# Altium project Hand Proto1.PrjPcb
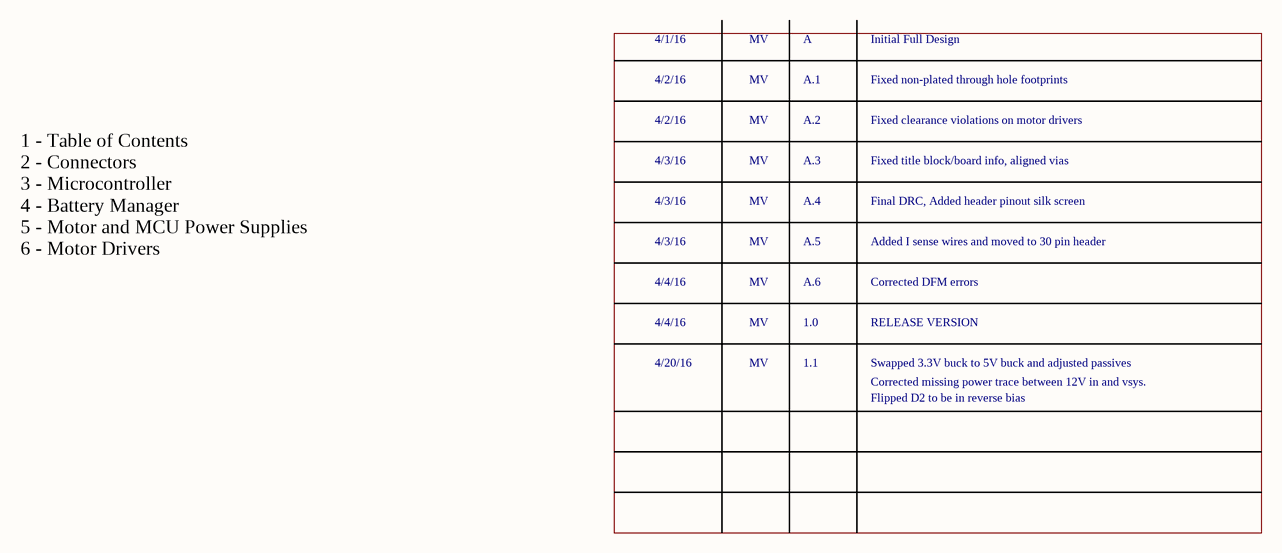
[diagram p0: TOC.SchDoc]
6 sheets, 165 parts. Net scope: global (net labels, ports and power ports of the same name join across sheets).
Board file: Hand Proto 1 PCB.PcbDoc
Sheets:
  TOC.SchDoc
  Connectors.SchDoc
  MCU.SchDoc
  Battery Manager.SchDoc
  Power_Supply.SchDoc
  Motor_Drivers.SchDoc

## Sheet TOC.SchDoc: Table of Contents
size A4; CompanyName: St. Cloud State University; Organization: Senior Design Project; Address1: Prosthetic Hand; Address2: Matthew Varas; Address3: Rachel Mertz; Address4: Donnell Jones; DocumentNumber: 1; Revision: 1.1; SheetNumber: 1; SheetTotal: 6

### Notes on the sheet
- 4/1/16
- 4/2/16
- MV
- A
- A.1
- Initial Full Design
- Fixed non-plated through hole footprints
- 4/3/16
- A.2
- A.3
- Fixed clearance violations on motor drivers
- Fixed title block/board info, aligned vias
- A.4
- Final DRC, Added header pinout silk screen
- 1 - Table of Contents
  2 - Connectors
  3 - Microcontroller
  4 - Battery Manager
  5 - Motor and MCU Power Supplies
  6 - Motor Drivers
- 4/4/16
- A.5
- A.6
- Added I sense wires and moved to 30 pin header
- Corrected DFM errors
- 4/20/16
- 1.0
- 1.1
- RELEASE VERSION
- Swapped 3.3V buck to 5V buck and adjusted passives
- Corrected missing power trace between 12V in and vsys.
- Flipped D2 to be in reverse bias
- Title
- Size:
- Date:
- A4
- Number:
- Time:
- Revision:
- Sheet
- of
- File:

## Sheet Connectors.SchDoc: Connectors
size A4; CompanyName: St. Cloud State University; Organization: Senior Design Project; Address1: Prosthetic Hand; Address2: Matthew Varas; Address3: Rachel Mertz; Address4: Donnell Jones; DocumentNumber: 2; Revision: 1.1; SheetNumber: 2; SheetTotal: 6
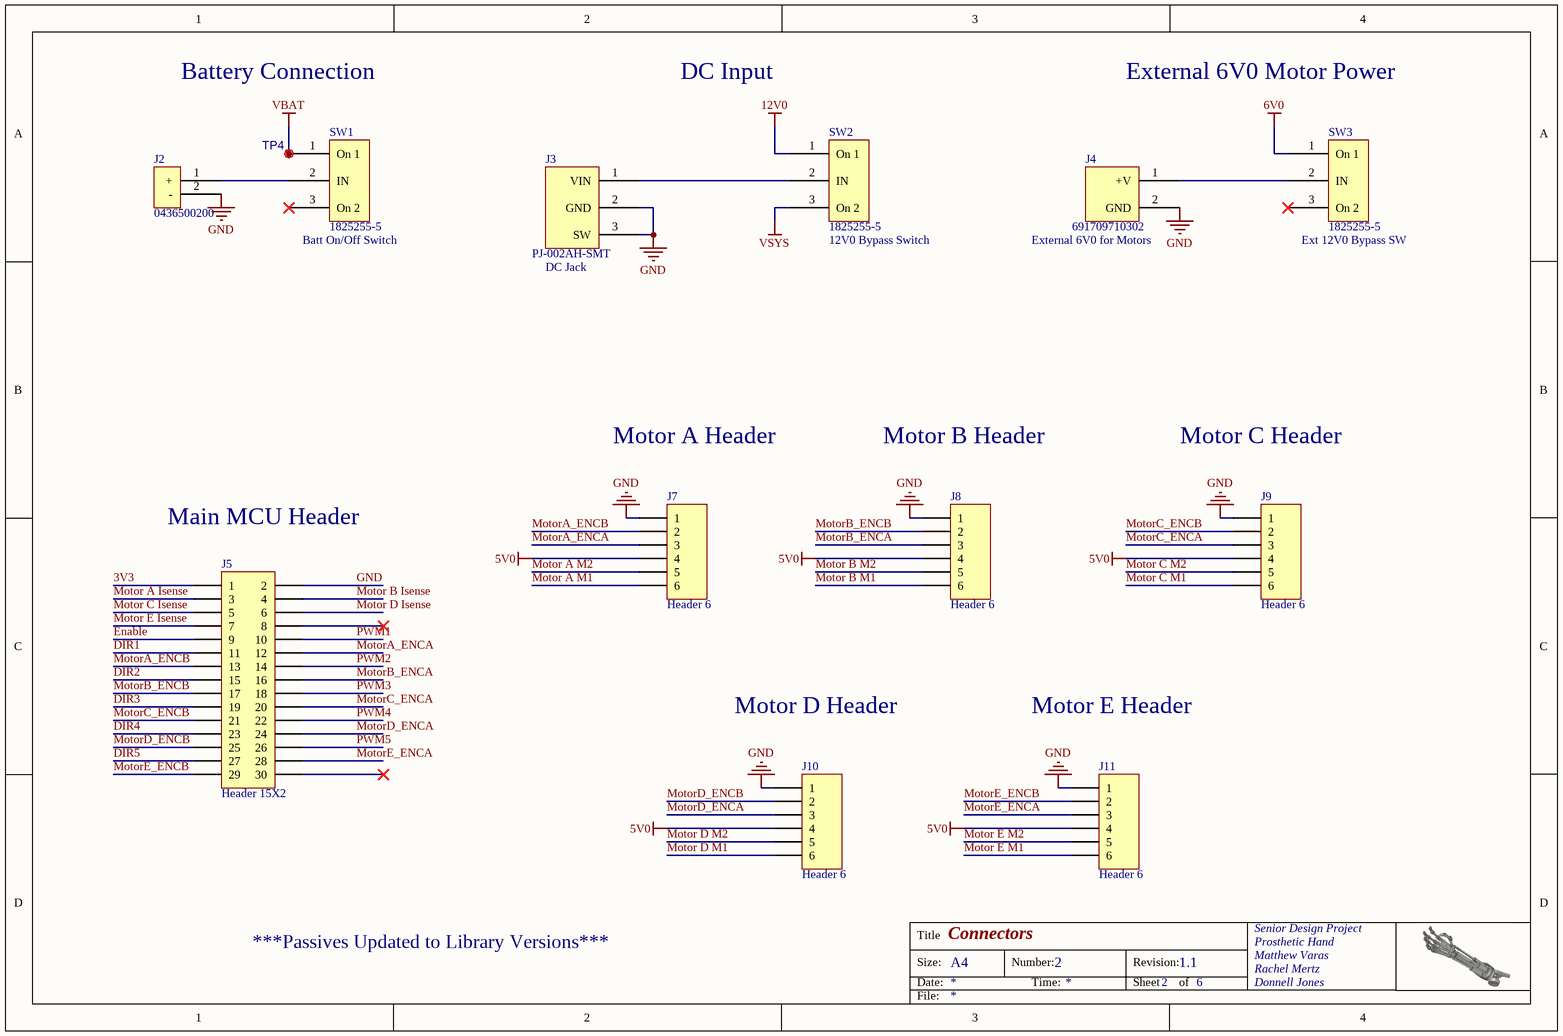
[diagram p1: Connectors.SchDoc]

### Parts
J2  0436500200  [43650-0200]
J3  PJ-002AH-SMT  [PJ-002AH-SMT]
J4  691709710302  [2-Pin Screw Terminal]
J5  Header 15X2  [HDR2X15]
J7  Header 6  [HDR1X6]
J8  Header 6  [HDR1X6]
J9  Header 6  [HDR1X6]
J10  Header 6  [HDR1X6]
J11  Header 6  [HDR1X6]
SW1  1825255-5  [On/Off/On Slider Switch]
SW2  1825255-5  [On/Off/On Slider Switch]
SW3  1825255-5  [On/Off/On Slider Switch]
TP4  Test Point  [Testpoint_70]  (value not drawn)

### Nets
3V3: J5.1
5V0: J7.4 J8.4 J9.4 J10.4 J11.4
6V0: SW3.1(On_1)
12V0: SW2.1(On_1)
GND: J2.2(-) J3.2(GND) J3.3(SW) J4.2(GND) J5.2 J7.1 J8.1 J9.1 J10.1 J11.1
VBAT: SW1.1(On_1) TP4.1(M80)
VSYS: SW2.3(On_2)
DIR1: J5.11
DIR2: J5.15
DIR3: J5.19
DIR4: J5.23
DIR5: J5.27
Enable: J5.9
Motor A Isense: J5.3
Motor A M1: J7.6
Motor A M2: J7.5
Motor B Isense: J5.4
Motor B M1: J8.6
Motor B M2: J8.5
Motor C Isense: J5.5
Motor C M1: J9.6
Motor C M2: J9.5
Motor D Isense: J5.6
Motor D M1: J10.6
Motor D M2: J10.5
Motor E Isense: J5.7
Motor E M1: J11.6
Motor E M2: J11.5
MotorA_ENCA: J5.12 J7.3
MotorA_ENCB: J5.13 J7.2
MotorB_ENCA: J5.16 J8.3
MotorB_ENCB: J5.17 J8.2
MotorC_ENCA: J5.20 J9.3
MotorC_ENCB: J5.21 J9.2
MotorD_ENCA: J5.24 J10.3
MotorD_ENCB: J5.25 J10.2
MotorE_ENCA: J5.28 J11.3
MotorE_ENCB: J5.29 J11.2
PWM1: J5.10
PWM2: J5.14
PWM3: J5.18
PWM4: J5.22
PWM5: J5.26
NetJ2_1: J2.1(+) SW1.2(IN)
NetJ3_1: J3.1(VIN) SW2.2(IN)
NetJ4_1: J4.1(+V) SW3.2(IN)

Not connected (* = marked no-connect by the designer): J5 8* 30*; SW1 3(On_2)*; SW3 3(On_2)*

### Notes on the sheet
- Battery Connection
- DC Input
- External 6V0 Motor Power
- Motor A Header
- Motor B Header
- Motor C Header
- Main MCU Header
- Motor D Header
- Motor E Header
- ***Passives Updated to Library Versions***
- Title
- Size:
- Date:
- A4
- Number:
- Time:
- Revision:
- Sheet
- of
- File:
- (in symbol 1825255-5) Batt On/Off Switch; 12V0 Bypass Switch; Ext 12V0 Bypass SW
- (in symbol PJ-002AH-SMT) DC Jack
- (in symbol Screw Terminal 2-pin) External 6V0 for Motors

### Library data of the parts
J2 = Battery Connector: CONN HEADER 2POS 3MM RT ANG TIN; MFG_NAME01: Molex; DIGI_PN01: WM1860-ND; MFG_PN01: 43650-0200
J3 = PJ-002AH-SMT: CONN POWER JACK 2.1X5.5MM HI CUR; MFG_PN01: PJ-002AH-SMT-TR; DIGI_PN01: CP-002AHPJCT-ND; MFG_NAME01: CUI Inc.
J4 = Screw Terminal 2-pin: CONN TERM BLOCK 2POS 5MM BLACK; MFG_NAME01: Wurth Electronics Inc; DIGI_PN01: 1297-1108-1-ND; MFG_PN01: 691709710302
J5 = Header 15X2: 30 Position Receptacle Connector 0.100" (2.54mm) Through Hole Tin; MFG_PN01: SSW-115-01-T-D; DIGI_PN01: SAM1212-15-ND; MFG_NAME01: Samtec Inc
J7-J11 = Header 6: 6 Positions Header, Unshrouded Connector 0.100" (2.54mm) Through Hole Tin; MFG_PN01: 3-644456-6; MFG_NAME01: TE Connectivity; DIGI_PN01: A31116-ND
SW1-SW3 = 1825255-5: SWITCH SLIDE SPDT 300MA 125V; MFG_NAME01: TE Connectivity; DIGI_PN01: 450-1569-ND; MFG_PN01: 1825255-5
TP4 = Test Point: Test Pad; MFG_PN01: DNP; MFG_NAME01: DNP; DNP: DNP

## Sheet MCU.SchDoc: Microcontroller
size A3; Organization: Senior Design Project; Address1: Prosthetic Hand; Address2: Matthew Varas; Address3: Rachel Mertz; Address4: Donnell Jones; DocumentNumber: 3; Revision: 1.1; SheetNumber: 3; SheetTotal: 6; DocumentName: 3
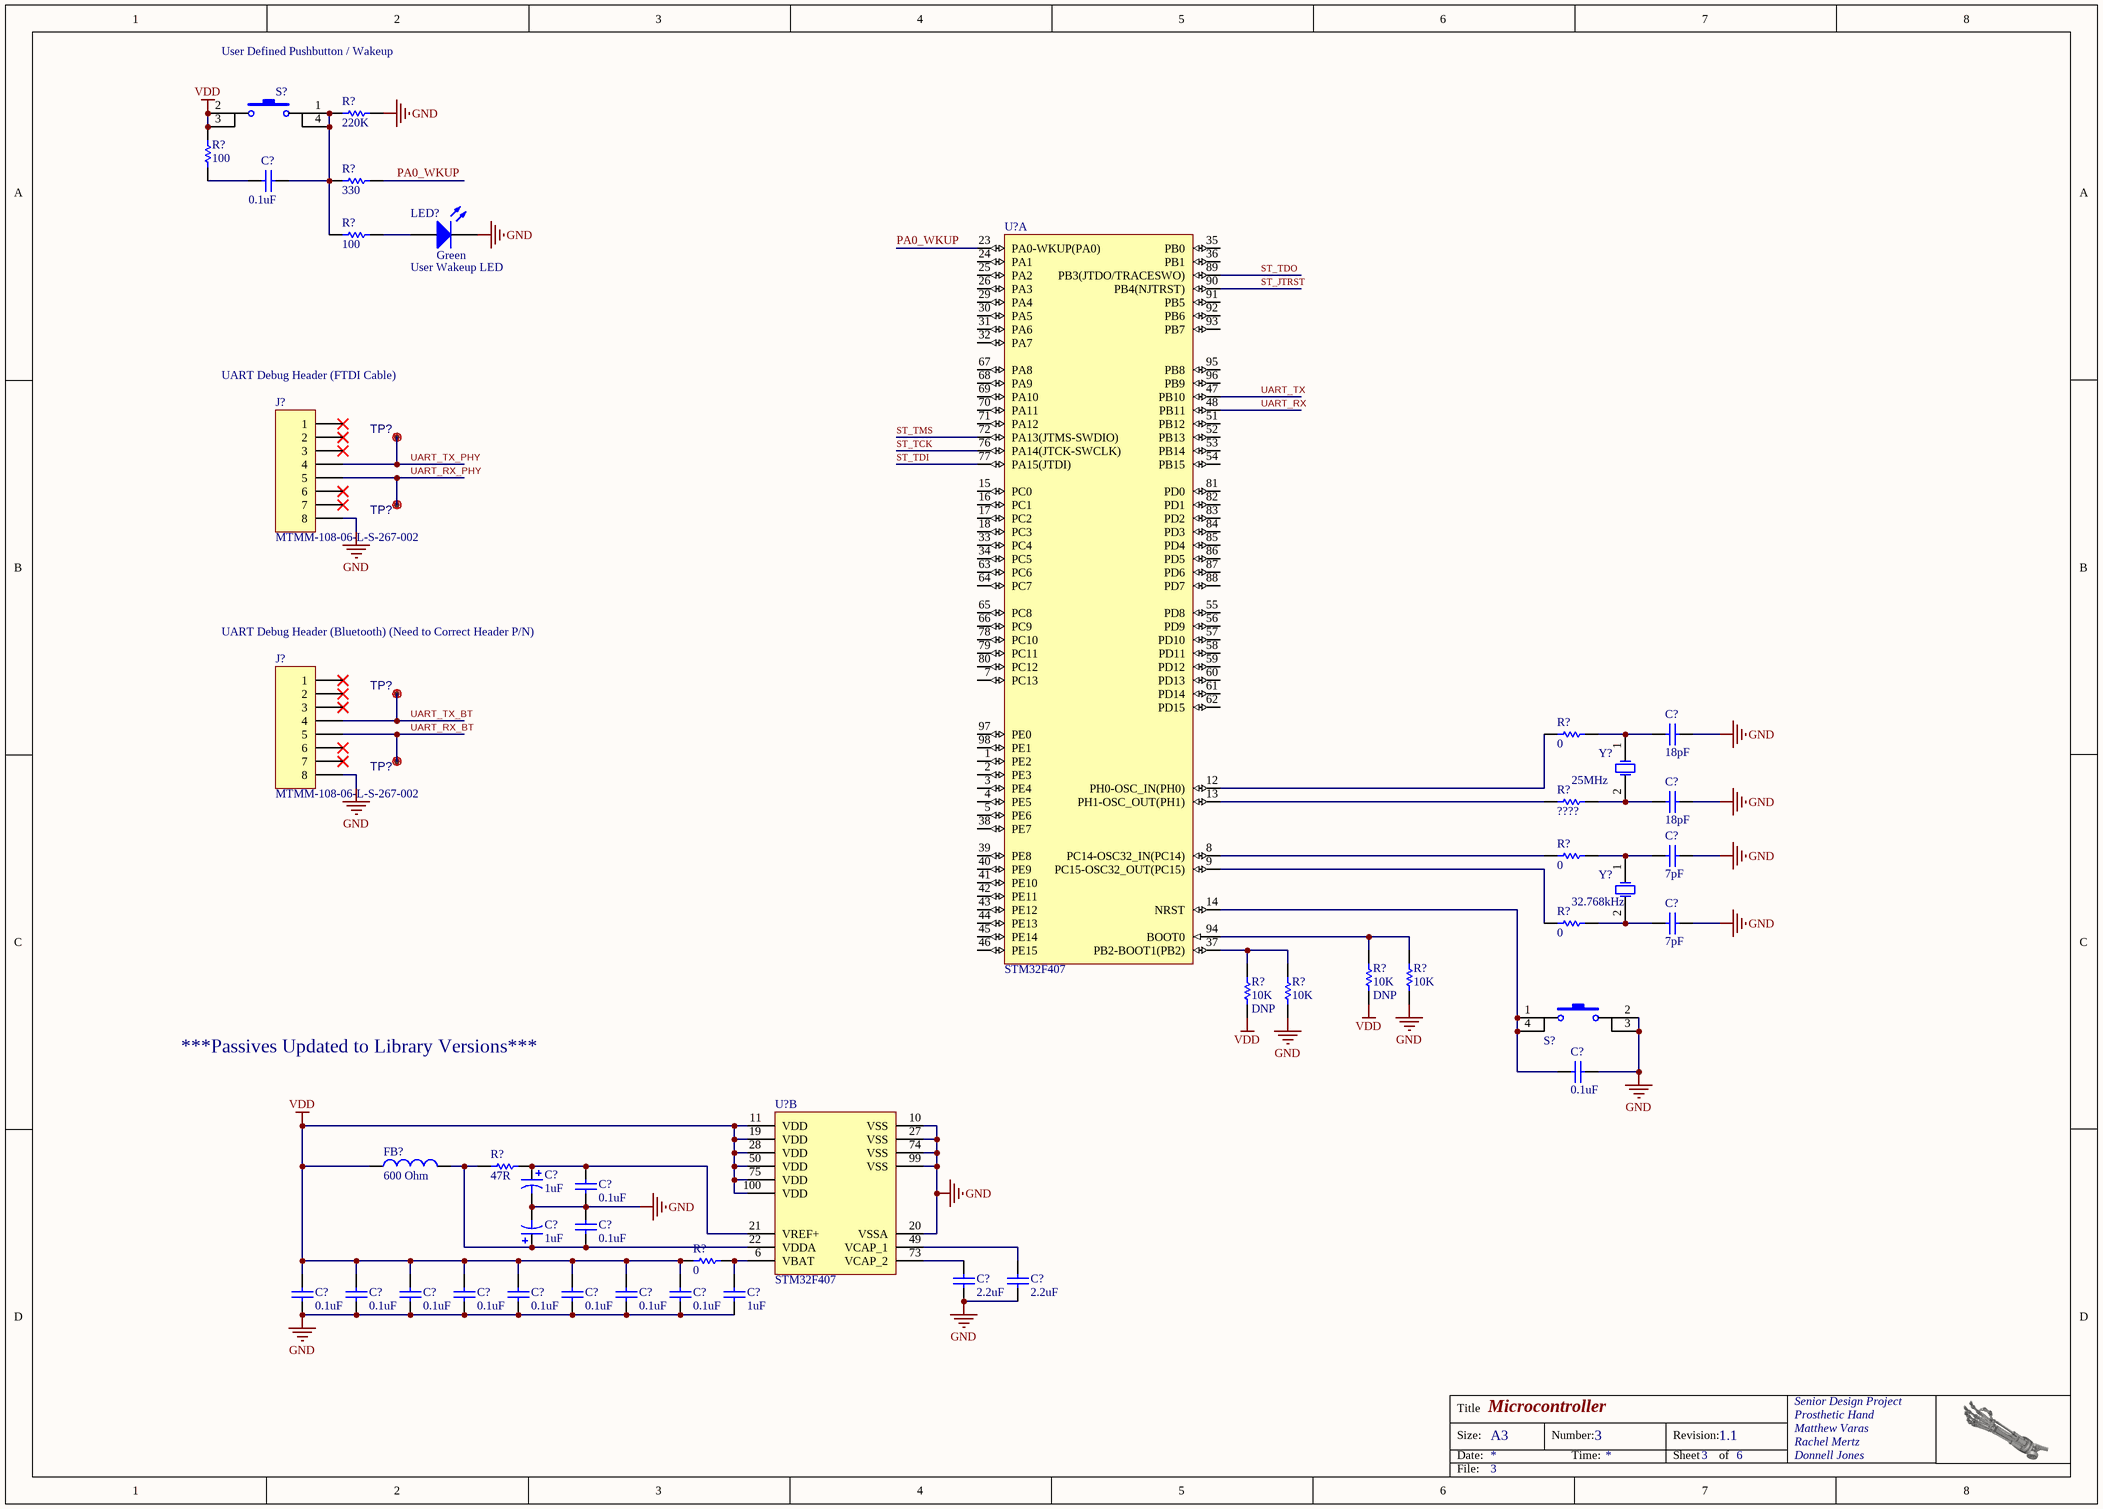
[diagram p2: MCU.SchDoc]

### Parts
(Parts that share a designator on the sheet are numbered #1, #2 ... from top to bottom, then left to right.)
C?#1  value 0.1uF  [0402 Cap]  (hidden comment: Cap)
C?#2  value 18pF  [0603 Cap]  (hidden comment: Cap)
C?#3  value 18pF  [0603 Cap]  (hidden comment: Cap)
C?#4  value 7pF  [0603 Cap]  (hidden comment: Cap)
C?#5  value 7pF  [0603 Cap]  (hidden comment: Cap)
C?#6  value 0.1uF  [0402 Cap]  (hidden comment: Cap)
C?#7  value 1uF  [Cap Tant A]  (hidden comment: Cap Tant)
C?#8  value 0.1uF  [0402 Cap]  (hidden comment: Cap)
C?#9  value 0.1uF  [0402 Cap]  (hidden comment: Cap)
C?#10  value 1uF  [Cap Tant A]  (hidden comment: Cap Tant)
C?#11  value 0.1uF  [0402 Cap]  (hidden comment: Cap)
C?#12  value 0.1uF  [0402 Cap]  (hidden comment: Cap)
C?#13  value 0.1uF  [0402 Cap]  (hidden comment: Cap)
C?#14  value 0.1uF  [0402 Cap]  (hidden comment: Cap)
C?#15  value 0.1uF  [0402 Cap]  (hidden comment: Cap)
C?#16  value 0.1uF  [0402 Cap]  (hidden comment: Cap)
C?#17  value 0.1uF  [0402 Cap]  (hidden comment: Cap)
C?#18  value 0.1uF  [0402 Cap]  (hidden comment: Cap)
C?#19  value 2.2uF  [1206 Cap]  (hidden comment: Cap)
C?#20  value 2.2uF  [1206 Cap]  (hidden comment: Cap)
C?#21  value 1uF  [0603 Cap]  (hidden comment: Cap)
FB?  value 600 Ohm  [0603 Resistor]  (hidden comment: Ferrite Bead)
J?#1  MFG_PN01: MTMM-108-06-L-S-267-002  [2mm_1x8_2NC]  (hidden comment: JTAG Header)
J?#2  MFG_PN01: MTMM-108-06-L-S-267-002  [2mm_1x8_2NC]  (hidden comment: JTAG Header)
LED?  User Wakeup LED  Color: Green  [LED 0603]
R?#1  value 220K  [0402 Resistor]  (hidden comment: Resistor)
R?#2  value 100  [0402 Resistor]  (hidden comment: Resistor)
R?#3  value 330  [0402 Resistor]  (hidden comment: Resistor)
R?#4  value 100  [0402 Resistor]  (hidden comment: Resistor)
R?#5  value 0  [0603 Resistor]  (hidden comment: Resistor)
R?#6  value ????  [0603 Resistor]  (hidden comment: Resistor)
R?#7  value 0  [0603 Resistor]  (hidden comment: Resistor)
R?#8  value 0  [0603 Resistor]  (hidden comment: Resistor)
R?#9  value 10K  [0402 Resistor]  (hidden comment: Resistor)
R?#10  value 10K  [0402 Resistor]  (hidden comment: Resistor)
R?#11  value 10K  [0402 Resistor]  (hidden comment: Resistor)
R?#12  value 10K  [0402 Resistor]  (hidden comment: Resistor)
R?#13  value 47R  [0603 Resistor]  (hidden comment: Resistor)
R?#14  value 0  [0603 Resistor]  (hidden comment: Resistor)
S?#1  SW-PB  [MJTP1138 Switch]  (value not drawn)
S?#2  SW-PB  [MJTP1138 Switch]  (value not drawn)
TP?#1  Test Point  [Testpoint_70]  (value not drawn)
TP?#2  Test Point  [Testpoint_70]  (value not drawn)
TP?#3  Test Point  [Testpoint_70]  (value not drawn)
TP?#4  Test Point  [Testpoint_70]  (value not drawn)
U?#1  STM32F407  [STM-LQFP100_V]  (part A of 2)
U?#2  STM32F407  [STM-LQFP100_V]  (part B of 2)
Y?#1  Frequency: 25MHz  [HC49/US Crystal]  (hidden comment: Crystal)
Y?#2  Frequency: 32.768kHz  [ECX-31B Crystal]  (hidden comment: Crystal)

### Nets
GND: C?#2.1 C?#3.1 C?#4.1 C?#5.1 C?#6.2 C?#7.2 C?#8.2 C?#9.1 C?#10.2 C?#11.2 C?#12.2 C?#13.2 C?#14.2 C?#15.2 C?#16.2 C?#17.2 C?#18.2 C?#19.1 C?#20.1 C?#21.1 J?#1.8 J?#2.8 LED?.2(K) R?#1.2 R?#10.1 R?#12.1 S?#2.2 S?#2.3 U?#2.10(VSS) U?#2.20(VSSA) U?#2.27(VSS) U?#2.74(VSS) U?#2.99(VSS)
VDD: C?#11.1 C?#12.1 C?#13.1 C?#14.1 C?#15.1 C?#16.1 C?#17.1 C?#18.1 FB?.1 R?#2.2 R?#9.1 R?#11.1 R?#14.1 S?#1.2 S?#1.3 U?#2.11(VDD) U?#2.19(VDD) U?#2.28(VDD) U?#2.50(VDD) U?#2.75(VDD) U?#2.100(VDD)
PA0_WKUP: R?#3.2 U?#1.23(PA0-WKUP(PA0))
ST_JTRST: U?#1.90(PB4(NJTRST))
ST_TCK: U?#1.76(PA14(JTCK-SWCLK))
ST_TDI: U?#1.77(PA15(JTDI))
ST_TDO: U?#1.89(PB3(JTDO/TRACESWO))
ST_TMS: U?#1.72(PA13(JTMS-SWDIO))
UART_RX: U?#1.48(PB11)
UART_RX_BT: J?#2.5 TP?#4.1(M80)
UART_RX_PHY: J?#1.5 TP?#2.1(M80)
UART_TX: U?#1.47(PB10)
UART_TX_BT: J?#2.4 TP?#3.1(M80)
UART_TX_PHY: J?#1.4 TP?#1.1(M80)
NetC?#1_1: C?#1.1 R?#1.1 R?#3.1 R?#4.1 S?#1.1 S?#1.4
NetC?#1_2: C?#1.2 R?#2.1
NetC?#2_2: C?#2.2 R?#5.2 Y?#1.1(OSC1)
NetC?#3_2: C?#3.2 R?#6.2 Y?#1.2(OSC2)
NetC?#4_2: C?#4.2 R?#7.2 Y?#2.1(OSC1)
NetC?#5_2: C?#5.2 R?#8.2 Y?#2.2(OSC2)
NetC?#6_1: C?#6.1 S?#2.1 S?#2.4 U?#1.14(NRST)
NetC?#7_1: C?#7.1 C?#8.1 R?#13.2 U?#2.21(VREF+)
NetC?#9_2: C?#9.2 C?#10.1 FB?.2 R?#13.1 U?#2.22(VDDA)
NetC?#19_2: C?#19.2 U?#2.73(VCAP_2)
NetC?#20_2: C?#20.2 U?#2.49(VCAP_1)
NetC?#21_2: C?#21.2 R?#14.2 U?#2.6(VBAT)
NetLED?_1: LED?.1(A) R?#4.2
NetR?#5_1: R?#5.1 U?#1.12(PH0-OSC_IN(PH0))
NetR?#6_1: R?#6.1 U?#1.13(PH1-OSC_OUT(PH1))
NetR?#7_1: R?#7.1 U?#1.8(PC14-OSC32_IN(PC14))
NetR?#8_1: R?#8.1 U?#1.9(PC15-OSC32_OUT(PC15))
NetR?#9_2: R?#9.2 R?#10.2 U?#1.94(BOOT0)
NetR?#11_2: R?#11.2 R?#12.2 U?#1.37(PB2-BOOT1(PB2))

Not connected (* = marked no-connect by the designer): J?#1 1* 2* 3* 6* 7*; J?#2 1* 2* 3* 6* 7*; U?#1 1(PE2) 2(PE3) 3(PE4) 4(PE5) 5(PE6) 7(PC13) 15(PC0) 16(PC1) 17(PC2) 18(PC3) 24(PA1) 25(PA2) 26(PA3) 29(PA4) 30(PA5) 31(PA6) 32(PA7) 33(PC4) 34(PC5) 35(PB0) 36(PB1) 38(PE7) 39(PE8) 40(PE9) 41(PE10) 42(PE11) 43(PE12) 44(PE13) 45(PE14) 46(PE15) 51(PB12) 52(PB13) 53(PB14) 54(PB15) 55(PD8) 56(PD9) 57(PD10) 58(PD11) 59(PD12) 60(PD13) 61(PD14) 62(PD15) 63(PC6) 64(PC7) 65(PC8) 66(PC9) 67(PA8) 68(PA9) 69(PA10) 70(PA11) 71(PA12) 78(PC10) 79(PC11) 80(PC12) 81(PD0) 82(PD1) 83(PD2) 84(PD3) 85(PD4) 86(PD5) 87(PD6) 88(PD7) 91(PB5) 92(PB6) 93(PB7) 95(PB8) 96(PB9) 97(PE0) 98(PE1)

### Notes on the sheet
- User Defined Pushbutton / Wakeup
- UART Debug Header (FTDI Cable)
- UART Debug Header (Bluetooth) (Need to Correct Header P/N)
- ***Passives Updated to Library Versions***
- Title
- Size:
- Date:
- A3
- Number:
- Time:
- Revision:
- Sheet
- of
- File:

### Library data of the parts
C?#1 C?#6 C?#8 C?#9 C?#11-C?#18 = Cap 0402: 0.10µF ±10% 16V X7R Ceramic Capacitor 0402; DIGI_PN01: 311-1338-1-ND; MFG_PN01: CC0402KRX7R7BB104; MFG_NAME01: Yageo; Footprint: 0402
C?#2 C?#3 = Cap 0603: 18pF ±1% 50V C0G, NP0 Ceramic Capacitor 0603; DIGI_PN01: 490-9716-1-ND; MFG_PN01: GRM1885C1H180FA01D; MFG_NAME01: Murata; Footprint: 0603
C?#4 C?#5 = Cap 0603: 7pF ±0.1pF 50V C0G, NP0 Ceramic Capacitor 0603; DIGI_PN01: 1276-2135-1-ND; MFG_PN01: CL10C070BB8NNNC; MFG_NAME01: Samsung; Footprint: 0603
C?#7 C?#10 = Cap Tant A: Tantalum Cap A; MFG_PN01: TAJA105K016RNJ; MFG_NAME01: AVX Corporation; DIGI_PN01: 478-1649-2-ND
C?#19 C?#20 = Cap 1206: 2.2µF ±10% 16V X7R Ceramic Capacitor 1206; DIGI_PN01: 311-1957-1-ND; MFG_PN01: CC1206KKX7R7BB225; MFG_NAME01: Yageo; Footprint: 1206
C?#21 = Cap 0603: 1µF ±10% 16V X5R Ceramic Capacitor 0603; DIGI_PN01: 311-1444-1-ND; MFG_PN01: CC0603KRX5R7BB105; MFG_NAME01: Yageo; Footprint: 0603
FB? = Inductor: FERRITE BEAD 600 OHM 0603 1LN; MFG_PN01: BK1608HS601-T; MFG_NAME01: Taiyo Yuden; DIGI_PN01: 587-1874-1-ND; Footprint: 0603
J?#1 J?#2 = JTAG Header: Header 8-pin keyed for FTDI Cable; MFG_NAME01: Samtec; DIGI_PN01: *
LED? = LED Green SMD: LED GREEN DIFFUSED 0603 SMD; MFG_PN01: SML-D12M8WT86; DIGI_PN01: 511-1578-1-ND; MFG_NAME01: Rohm Semiconductor; Published: 8-Jun-2000; LatestRevisionDate: 08-Jul-2005; LatestRevisionNote: Mech Layer 1 removed.; PackageReference: LED-1; Publisher: Altium Limited; PackageDescription: LED; 2 Leads
R?#1 = Resistor 0402: RES SMD 220K OHM 1% 1/16W 0402; MFG_PN01: AC0402FR-07220KL; MFG_NAME01: Yageo; DIGI_PN01: 311-220KLBCT-ND; Footprint: 0402
R?#2 R?#4 = Resistor 0402: RES SMD 100 OHM 1% 1/16W 0402; MFG_PN01: 311-100LRCT-ND; MFG_NAME01: RC0402FR-07100RL; DIGI_PN01: Yageo; Footprint: 0402
R?#3 = Resistor 0402: RES SMD 330 OHM 1% 1/16W 0402; MFG_PN01: RC0402FR-07330RL; MFG_NAME01: Yageo; DIGI_PN01: 311-330LRCT-ND; Footprint: 0402
R?#5 R?#7 R?#8 R?#14 = Resistor 0603: RES SMD 0.0OHM JUMPER 1/10W 0603; MFG_PN01: RC0603JR-070RL; MFG_NAME01: Yageo; DIGI_PN01: 311-0.0GRCT-ND; Footprint: 0603
R?#6 = Resistor 0603: *; MFG_PN01: *; MFG_NAME01: *; Footprint: 0603; DIGI_PN01: *
R?#9-R?#12 = Resistor 0402: RES SMD 10K OHM 1% 1/16W 0402; MFG_PN01: RC0402FR-0710KL; MFG_NAME01: Yageo; DIGI_PN01: 311-10.0KLRCT-ND; Footprint: 0402; DNP: DNP
R?#13 = Resistor 0603: RES SMD 47 OHM 1% 1/10W 0603; MFG_PN01: RC0603FR-0747RL; MFG_NAME01: Yageo; DIGI_PN01: 311-47.0HRCT-ND; Footprint: 0603
S?#1 S?#2 = SW-PB: SWITCH TACTILE SPST-NO 0.05A 12V; MFG_PN01: MJTP1138ATR; MFG_NAME01: Apem Inc.; DIGI_PN01: 679-2413-1-ND
  S?#2: Published: 24-Mar-1999; LatestRevisionDate: 17-Jul-2002; LatestRevisionNote: Re-released for DXP Platform.; PackageReference: SPST-2; Publisher: Altium Limited; PackageDescription: Switch; 2 Leads
TP?#1-TP?#4 = Test Point: Test Pad; MFG_PN01: DNP; MFG_NAME01: DNP; DNP: DNP
U?#1 U?#2 = STM32F507VGT6: IC MCU 32BIT 1MB FLASH 100LQFP; MFG_PN01: STM32F407VGT6; MFG_NAME01: STMicroelectronics; DIGI_PN01: 497-11605-ND; Footprint: 100-LQFP
Y?#1 = Crystal: 25MHz ±20ppm Crystal 18pF 30 Ohm; MFG_NAME01: ECS Inc.; MFG_PN01: ECS-250-18-5PX-JEM-TR; DIGI_PN01: XC2083CT-ND
Y?#2 = Crystal: 32.768kHz ±20ppm Crystal 7pF 70 kOhm; MFG_NAME01: ECS Inc.; MFG_PN01: ECS-.327-7-34B-TR; DIGI_PN01: XC1656CT-ND

## Sheet Battery Manager.SchDoc: Battery Manager
size A4; CompanyName: St. Cloud State University; Organization: Senior Design Project; Address1: Prosthetic Hand; Address2: Matthew Varas; Address3: Rachel Mertz; Address4: Donnell Jones; DocumentNumber: 4; Revision: 1.1; SheetNumber: 4; SheetTotal: 6
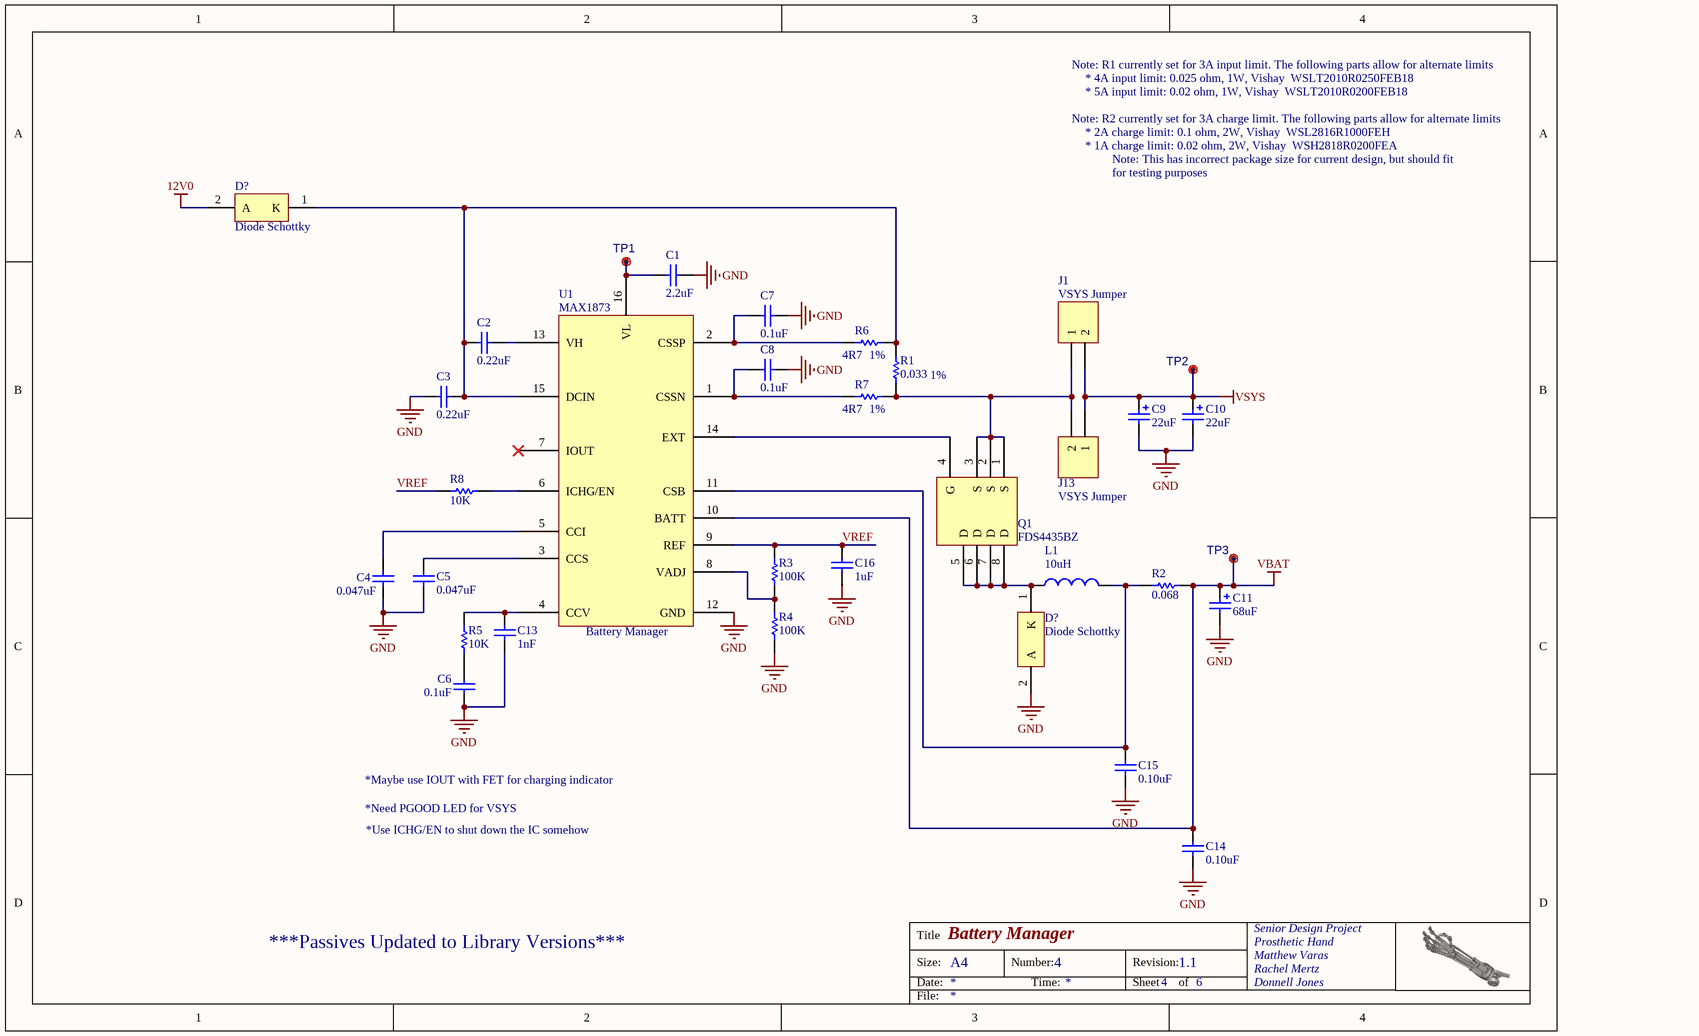
[diagram p3: Battery Manager.SchDoc]

### Parts
(Parts that share a designator on the sheet are numbered #1, #2 ... from top to bottom, then left to right.)
C1  value 2.2uF  [0805 Cap]  (hidden comment: Cap)
C2  value 0.22uF  [0805 Cap]  (hidden comment: Cap)
C3  value 0.22uF  [0805 Cap]  (hidden comment: Cap)
C4  value 0.047uF  [0805 Cap]  (hidden comment: Cap)
C5  value 0.047uF  [0805 Cap]  (hidden comment: Cap)
C6  value 0.1uF  [0805 Cap]  (hidden comment: Cap)
C7  value 0.1uF  Tolerance: 1%  [0805 Cap]  (hidden comment: Cap)
C8  value 0.1uF  [0805 Cap]  (hidden comment: Cap)
C9  22uF  [Cap Tant D]
C10  22uF  [Cap Tant D]
C11  68uF  [Cap Tant E]
C13  value 1nF  [0603 Cap]  (hidden comment: Cap)
C14  value 0.10uF  [0805 Cap]  (hidden comment: Cap)
C15  value 0.10uF  [0805 Cap]  (hidden comment: Cap)
C16  value 1uF  [0805 Cap]  (hidden comment: Cap)
D?#1  Diode Schottky  [ONSC-SMC-2-403-03_V]
D?#2  Diode Schottky  [ONSC-SMC-2-403-03_V]
J1  VSYS Jumper  [HDR1X2]
J13  VSYS Jumper  [HDR1X2]
L1  10uH  [SRR1260 Ind]
Q1  FDS4435BZ  [SOIC-8]
R1  value 0.033  Tolerance: 1%  [2010 Resistor]  (hidden comment: Resistor)
R2  0.068  [WSL2816]
R3  value 100K  [0805 Resistor]  (hidden comment: Resistor)
R4  value 100K  [0805 Resistor]  (hidden comment: Resistor)
R5  value 10K  [0805 Resistor]  (hidden comment: Resistor)
R6  value 4R7  [0603 Resistor]  (hidden comment: Resistor)
R7  value 4R7  Tolerance: 1%  [0603 Resistor]  (hidden comment: Resistor)
R8  value 10K  [0805 Resistor]  (hidden comment: Resistor)
TP1  Test Point  [Testpoint_70]  (value not drawn)
TP2  Test Point  [Testpoint_70]  (value not drawn)
TP3  Test Point  [Testpoint_70]  (value not drawn)
U1  MAX1873  Desc: Battery Manager  [QSOP-16]

### Nets
12V0: D?#1.2(A)
GND: C1.1 C3.2 C4.1 C5.1 C6.2 C7.1 C8.1 C9.2 C10.2 C11.2 C13.1 C14.1 C15.1 C16.1 D?#2.2(A) R4.1 U1.12(GND)
VBAT: C11.1 C14.2 R2.1 TP3.1(M80) U1.10(BATT)
VSYS: C9.1 C10.1 J1.2 J13.1 TP2.1(M80)
VREF: C16.2 R3.2 R8.1 U1.9(REF)
NetC1_2: C1.2 TP1.1(M80) U1.16(VL)
NetC2_1: C2.1 U1.13(VH)
NetC2_2: C2.2 C3.1 D?#1.1(K) R1.2 R6.2 U1.15(DCIN)
NetC4_2: C4.2 U1.5(CCI)
NetC5_2: C5.2 U1.3(CCS)
NetC6_1: C6.1 R5.1
NetC7_2: C7.2 R6.1 U1.2(CSSP)
NetC8_2: C8.2 R7.1 U1.1(CSSN)
NetC13_2: C13.2 R5.2 U1.4(CCV)
NetC15_2: C15.2 L1.2 R2.2 U1.11(CSB)
NetD?#2_1: D?#2.1(K) L1.1 Q1.5(D) Q1.6(D) Q1.7(D) Q1.8(D)
NetJ1_1: J1.1 J13.2 Q1.1(S) Q1.2(S) Q1.3(S) R1.1 R7.2
NetQ1_4: Q1.4(G) U1.14(EXT)
NetR3_1: R3.1 R4.2 U1.8(VADJ)
NetR8_2: R8.2 U1.6(ICHG/EN)

Not connected (* = marked no-connect by the designer): U1 7(IOUT)*

### Notes on the sheet
- Note: R1 currently set for 3A input limit. The following parts allow for alternate limits
- * 4A input limit: 0.025 ohm, 1W, Vishay  WSLT2010R0250FEB18
- * 5A input limit: 0.02 ohm, 1W, Vishay  WSLT2010R0200FEB18
- Note: R2 currently set for 3A charge limit. The following parts allow for alternate limits
- * 2A charge limit: 0.1 ohm, 2W, Vishay  WSL2816R1000FEH
- * 1A charge limit: 0.02 ohm, 2W, Vishay  WSH2818R0200FEA
- Note: This has incorrect package size for current design, but should fit
- for testing purposes
- *Maybe use IOUT with FET for charging indicator
- *Need PGOOD LED for VSYS
- *Use ICHG/EN to shut down the IC somehow
- ***Passives Updated to Library Versions***
- Title
- Size:
- Date:
- A4
- Number:
- Time:
- Revision:
- Sheet
- of
- File:

### Library data of the parts
C1 = Cap 0805: 2.2µF ±10% 50V X5R Ceramic Capacitor 0805; DIGI_PN01: 445-14407-1-ND; MFG_PN01: C2012X5R1H225K085AB; MFG_NAME01: TDK Corporation; Footprint: 0805
C2 C3 = Cap 0805: 0.22µF ±10% 35V X5R Ceramic Capacitor 0805; DIGI_PN01: 587-3366-1-ND; MFG_PN01: GMK212BJ224KGHT; MFG_NAME01: Taiyo Yuden; Footprint: 0805
C4 C5 = Cap 0805: 0.047µF ±10% 50V X7R Ceramic Capacitor 0805; DIGI_PN01: 490-8050-1-ND; MFG_PN01: GCM21BR71H473KA37L; MFG_NAME01: Murata; Footprint: 0805
C6-C8 C14 C15 = Cap 0805: 0.10µF ±10% 50V X7R Ceramic Capacitor 0805; DIGI_PN01: 445-6045-1-ND; MFG_PN01: C2012X7R1H104K125AM; MFG_NAME01: TDK Corporation; Footprint: 0805
C9 C10 = Cap Pol2: CAP TANT 22UF 35V 10% 2917; DIGI_PN01: 478-3356-1-ND; MFG_NAME01: AVX; MFG_PN01: TPSD226K035R0200; Case-EIA: 2917; Value: 22uF
C11 = Cap Pol2: CAP TANT 68UF 25V 20% 2917; DIGI_PN01: 478-4152-1-ND; MFG_NAME01: AVX; MFG_PN01: TPSE686M025R0125; Case-EIA: 2917; Value: 68uF
C13 = Cap 0603: 1000pF ±10% 50V X7R Ceramic Capacitor 0603; DIGI_PN01: 490-1494-1-ND; MFG_PN01: GRM188R71H102KA01D; MFG_NAME01: Murata; Footprint: 0603
C16 = Cap 0805: 1µF ±10% 25V X7R Ceramic Capacitor 0805; DIGI_PN01: 445-1354-1-ND; MFG_PN01: C2012X7R1E105K125AB; MFG_NAME01: TDK Corporation; Footprint: 0805
D?#1 D?#2 = Diode MBRS340T3G: DIODE SCHOTTKY 40V 4A SMC; MFG_NAME01: ON Semiconductor; DIGI_PN01: MBRS340T3GOSCT-ND; MFG_PN01: MBRS340T3G
J1 J13 = Header 2: PEC02SAAN; MFG_NAME01: Sullins Connector Solutions; DIGI_PN01: S1012E-02-ND; MFG_PN01: PEC02SAAN
L1 = SRR1260A-100MCT-ND: FIXED IND 10UH 5.5A 20 MOHM SMD; MFG_NAME01: Bourns; Current Rating: 5.5A; MFG_PN01: SRR1260A-100M; DIGI_PN01: SRR1260A-100MCT-ND; Value: 10uH
Q1 = FDS4435BZ: MOSFET P-CH 30V 8.8A 8-SOIC; MFG_NAME01: Fairchild Semiconductor; DIGI_PN01: FDS4435BZCT-ND; MFG_PN01: FDS4435BZ; Case-EIA: 8-SOIC
R1 = Resistor 2010: RES SMD 0.033 OHM 1% 1W 2010; MFG_PN01: WSL2010R0330FEA18; MFG_NAME01: Vishay Dale; DIGI_PN01: WSLF-.033CT-ND; Footprint: 2010
R2 = CMP-1017-00002-1: RES SMD 0.068 OHM 1% 2W 2816; Case-Metric: 5025; Case-EIA: 2816; MFG_PN01: WSL2816R0680FEH; DIGI_PN01: WSLK-.068CT-ND; MFG_NAME01: Vishay Dale; Tolerance: 1%; Technology: SMT; Power: 2W; Value: 0.068
R3 R4 = Resistor 0805: RES SMD 100K OHM 1% 1/8W 0805; MFG_PN01: RC0805FR-07100KL; MFG_NAME01: Yageo; DIGI_PN01: 311-100KCRCT-ND; Footprint: 0805
R5 R8 = Resistor 0805: RES SMD 10K OHM 1% 1/8W 0805; MFG_PN01: RC0805FR-0710KL; MFG_NAME01: Yageo; DIGI_PN01: 311-10.0KCRCT-ND; Footprint: 0805
R6 R7 = Resistor 0603: RES SMD 4.7 OHM 1% 1/10W 0603; MFG_PN01: RC1608F4R7CS; MFG_NAME01: Samsung; DIGI_PN01: 1276-4486-1-ND; Footprint: 0603
TP1-TP3 = Test Point: Test Pad; MFG_PN01: DNP; MFG_NAME01: DNP; DNP: DNP
U1 = MAX1873: IC CNTRLR CHARGE LI+ 16-QSOP; MFG_PN01: MAX1873REEE+T; MFG_NAME01: Maxim Integrated; DIGI_PN01: MAX1873REEE+TCT-ND; Case-EIA: 16-SSOP

## Sheet Power_Supply.SchDoc: Power Supply
size A4; CompanyName: St. Cloud State University; Organization: Senior Design Project; Address1: Prosthetic Hand; Address2: Matthew Varas; Address3: Rachel Mertz; Address4: Donnell Jones; DocumentNumber: 5; Revision: 1.1; SheetNumber: 5; SheetTotal: 6
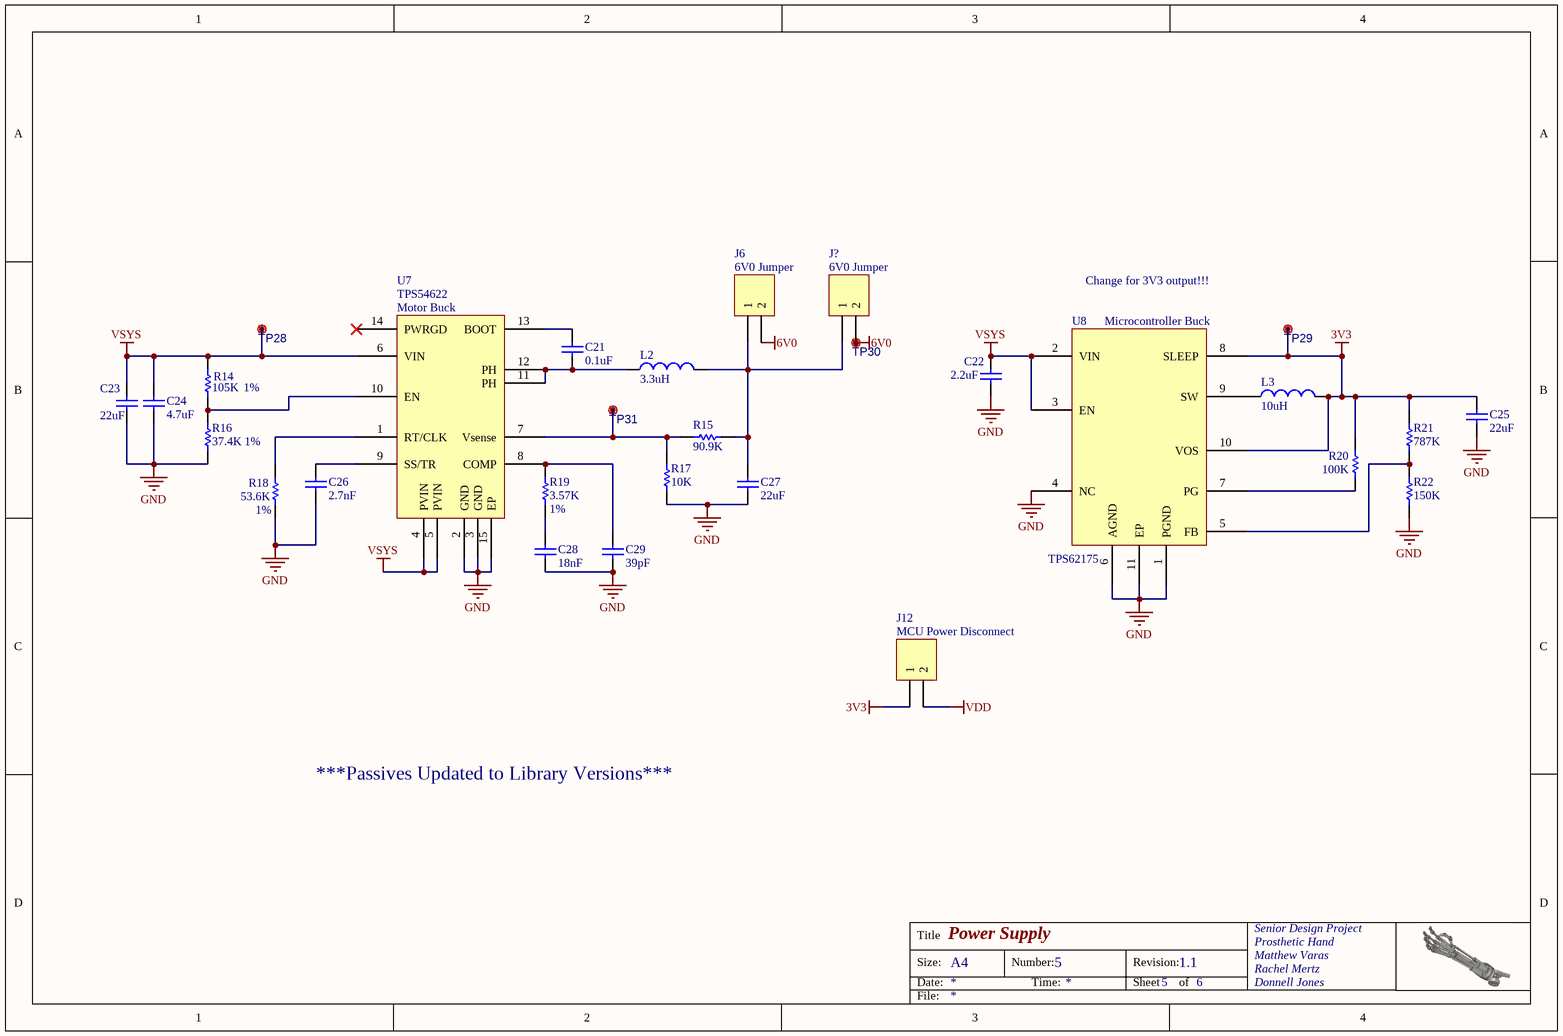
[diagram p4: Power_Supply.SchDoc]

### Parts
(Parts that share a designator on the sheet are numbered #1, #2 ... from top to bottom, then left to right.)
C21  value 0.1uF  [0805 Cap]  (hidden comment: Cap)
C22  value 2.2uF  [0603 Cap]  (hidden comment: Cap)
C23  value 22uF  [1206 Cap]  (hidden comment: Cap)
C24  value 4.7uF  [0805 Cap]  (hidden comment: Cap)
C25  value 22uF  [0805 Cap]  (hidden comment: Cap)
C26  value 2.7nF  [0805 Cap]  (hidden comment: Cap)
C27  value 22uF  [1206 Cap]  (hidden comment: Cap)
C28  value 18nF  [0805 Cap]  (hidden comment: Cap)
C29  value 39pF  [0805 Cap]  (hidden comment: Cap)
J6  6V0 Jumper  [HDR1X2]
J12  MCU Power Disconnect  [HDR1X2]
J?#3  6V0 Jumper  [HDR1X2]
L2  value 3.3uH  [INDM7265X40N]  (hidden comment: Inductor)
L3  value 10uH  [SDR0503]  (hidden comment: Inductor)
R14  value 105K  Tolerance: 1%  [0402 Resistor]  (hidden comment: Resistor)
R15  value 90.9K  [0402 Resistor]  (hidden comment: Resistor)
R16  value 37.4K  Tolerance: 1%  [0402 Resistor]  (hidden comment: Resistor)
R17  value 10K  [0402 Resistor]  (hidden comment: Resistor)
R18  value 53.6K  Tolerance: 1%  [0402 Resistor]  (hidden comment: Resistor)
R19  value 3.57K  Tolerance: 1%  [0402 Resistor]  (hidden comment: Resistor)
R20  value 100K  [0402 Resistor]  (hidden comment: Resistor)
R21  value 787K  [0603 Resistor]  (hidden comment: Resistor)
R22  value 150K  [0603 Resistor]  (hidden comment: Resistor)
TP28  Test Point  [Testpoint_70]  (value not drawn)
TP29  Test Point  [Testpoint_70]  (value not drawn)
TP30  Test Point  [Testpoint_70]  (value not drawn)
TP31  Test Point  [Testpoint_70]  (value not drawn)
U7  TPS54622  Desc: Motor Buck  [S-PVQFN-N14]
U8  TPS62175  Desc: Microcontroller Buck  [R-PWSON-N10]

### Nets
3V3: C25.2 J12.1 L3.2 R20.2 R21.2 TP29.1(M80) U8.8(SLEEP) U8.10(VOS)
6V0: J6.2 J?#3.2 TP30.1(M80)
GND: C22.1 C23.1 C24.1 C25.1 C26.1 C27.1 C28.1 C29.1 R16.1 R17.1 R18.1 R22.1 U7.2(GND) U7.3(GND) U7.15(EP) U8.1(PGND) U8.4(NC) U8.6(AGND) U8.11(EP)
VDD: J12.2
VSYS: C22.2 C23.2 C24.2 R14.2 TP28.1(M80) U7.4(PVIN) U7.5(PVIN) U7.6(VIN) U8.2(VIN) U8.3(EN)
NetC21_1: C21.1 L2.1 U7.11(PH) U7.12(PH)
NetC21_2: C21.2 U7.13(BOOT)
NetC26_2: C26.2 U7.9(SS/TR)
NetC27_2: C27.2 J6.1 J?#3.1 L2.2 R15.2
NetC28_2: C28.2 R19.1
NetC29_2: C29.2 R19.2 U7.8(COMP)
NetL3_1: L3.1 U8.9(SW)
NetR14_1: R14.1 R16.2 U7.10(EN)
NetR15_1: R15.1 R17.2 TP31.1(M80) U7.7(Vsense)
NetR18_2: R18.2 U7.1(RT/CLK)
NetR20_1: R20.1 U8.7(PG)
NetR21_1: R21.1 R22.2 U8.5(FB)

Not connected (* = marked no-connect by the designer): U7 14(PWRGD)*

### Notes on the sheet
- Change for 3V3 output!!!
- ***Passives Updated to Library Versions***
- Title
- Size:
- Date:
- A4
- Number:
- Time:
- Revision:
- Sheet
- of
- File:

### Library data of the parts
C21 = Cap 0805: 0.10µF ±10% 25V X7R Ceramic Capacitor 0805; DIGI_PN01: 478-3755-1-ND; MFG_PN01: 08053C104KAT2A; MFG_NAME01: AVX Corporation; Footprint: 0805
C22 = Cap 0603: 2.2µF ±10% 16V X5R Ceramic Capacitor 0603; DIGI_PN01: 490-3296-1-ND; MFG_PN01: GRM188R61C225KE15D; MFG_NAME01: Murata; Footprint: 0603
C23 = Cap 1206: 22µF ±20% 16V X5R Ceramic Capacitor 1206; DIGI_PN01: 490-4739-1-ND; MFG_PN01: GRM31CR61C226ME15L; MFG_NAME01: Murata; Footprint: 1206
C24 = Cap 0805: 4.7µF ±10% 25V X5R Ceramic Capacitor 0805; DIGI_PN01: 490-3335-1-ND; MFG_PN01: GRM21BR61E475KA12L; MFG_NAME01: Murata; Footprint: 0805
C25 = Cap 0805: 22µF ±20% 6.3V X5R Ceramic Capacitor 0805; DIGI_PN01: 490-1719-1-ND; MFG_PN01: GRM21BR60J226ME39L; MFG_NAME01: Murata; Footprint: 0805
C26 = Cap 0805: 2700pF ±10% 50V X7R Ceramic Capacitor 0805; DIGI_PN01: 311-1130-1-ND; MFG_PN01: CC0805KRX7R9BB272; MFG_NAME01: Yageo; Footprint: 0805
C27 = Cap 1206: 22µF ±10% 10V X5R Ceramic Capacitor 1206; DIGI_PN01: 490-6510-1-ND; MFG_PN01: GRM31CR61A226KE19L; MFG_NAME01: Murata; Footprint: 1206
C28 = Cap 0805: 0.018µF ±10% 50V X7R Ceramic Capacitor 0805; DIGI_PN01: 311-1137-1-ND; MFG_PN01: CC0805KRX7R9BB183; MFG_NAME01: Yageo; Footprint: 0805
C29 = Cap 0805: 39pF ±5% 50V C0G, NP0 Ceramic Capacitor 0805; DIGI_PN01: 311-1106-1-ND; MFG_PN01: CC0805JRNPO9BN390; MFG_NAME01: Yageo; Footprint: 0805
J6 J12 J?#3 = Header 2: as J1 on sheet Battery Manager; MFG_PN01: PEC02SAAN
L2 = Inductor: *; MFG_PN01: SRP6540-3R3M; MFG_NAME01: Bourns Inc.; DIGI_PN01: SRP6540-3R3MCT-ND
L3 = Inductor: FIXED IND 10UH 1.3A 130 MOHM SMD; MFG_PN01: SDR0503-100ML; MFG_NAME01: Bourns Inc.; DIGI_PN01: SDR0503-100MLCT-ND
R14 = Resistor 0402: RES SMD 105K OHM 1% 1/16W 0402; MFG_PN01: CRCW0402105KFKED; MFG_NAME01: Vishay Dale; DIGI_PN01: 541-105KLCT-ND; Footprint: 0402
R15 = Resistor 0402: RES SMD 90.9K OHM 1% 1/16W 0402; MFG_PN01: CRCW040290K9FKED; MFG_NAME01: Vishay Dale; DIGI_PN01: 541-90.9KLCT-ND; Footprint: 0402
R16 = Resistor 0402: RES SMD 37.4K OHM 1% 1/16W 0402; MFG_PN01: CRCW040237K4FKED; MFG_NAME01: Vishay Dale; DIGI_PN01: 541-37.4KLCT-ND; Footprint: 0402
R17 = Resistor 0402: as R?#9 on sheet MCU; Footprint: 0402; DNP: DNP
R18 = Resistor 0402: RES SMD 53.6K OHM 1% 1/16W 0402; MFG_PN01: CRCW040253K6FKED; MFG_NAME01: Vishay Dale; DIGI_PN01: 541-53.6KLCT-ND; Footprint: 0402
R19 = Resistor 0402: RES SMD 3.57K OHM 1% 1/16W 0402; MFG_PN01: CRCW04023K57FKED; MFG_NAME01: Vishay Dale; DIGI_PN01: 541-3.57KLCT-ND; Footprint: 0402
R20 = Resistor 0402: RES SMD 100K OHM 1% 1/16W 0402; MFG_PN01: CRCW0402100KFKED; MFG_NAME01: Vishay Dale; DIGI_PN01: 541-100KLCT-ND; Footprint: 0402
R21 = Resistor 0603: RES SMD 787K OHM 1% 1/10W 0603; MFG_PN01: RC0603FR-07787KL; MFG_NAME01: Yageo; DIGI_PN01: 311-787KHRCT-ND; Footprint: 0603
R22 = Resistor 0603: RES SMD 150K OHM 0.1% 1/10W 0603; MFG_PN01: RT0603BRD07150KL; MFG_NAME01: Yageo; DIGI_PN01: YAG1532CT-ND; Footprint: 0603
TP28-TP31 = Test Point: Test Pad; MFG_PN01: DNP; MFG_NAME01: DNP; DNP: DNP
U7 = TPS54622: IC REG BUCK ADJ 6A SYNC 14QFN; MFG_PN01: TPS54622RHLR; MFG_NAME01: Texas Instruments; DIGI_PN01: 296-29204-1-ND; Case-EIA: 14-VFQFN
U8 = TPS62175: IC REG BUCK BST 5V 0.8A 10WSON; MFG_NAME01: Texas Instruments; MFG_PN01: TPS62175DQCR; DIGI_PN01: 296-39451-1-ND; Case-EIA: 10-WFDFN

## Sheet Motor_Drivers.SchDoc: Motor Drivers
size A4; CompanyName: St. Cloud State University; Organization: Senior Design Project; Address1: Prosthetic Hand; Address2: Matthew Varas; Address3: Rachel Mertz; Address4: Donnell Jones; DocumentNumber: 6; Revision: 1.1; SheetNumber: 6; SheetTotal: 6
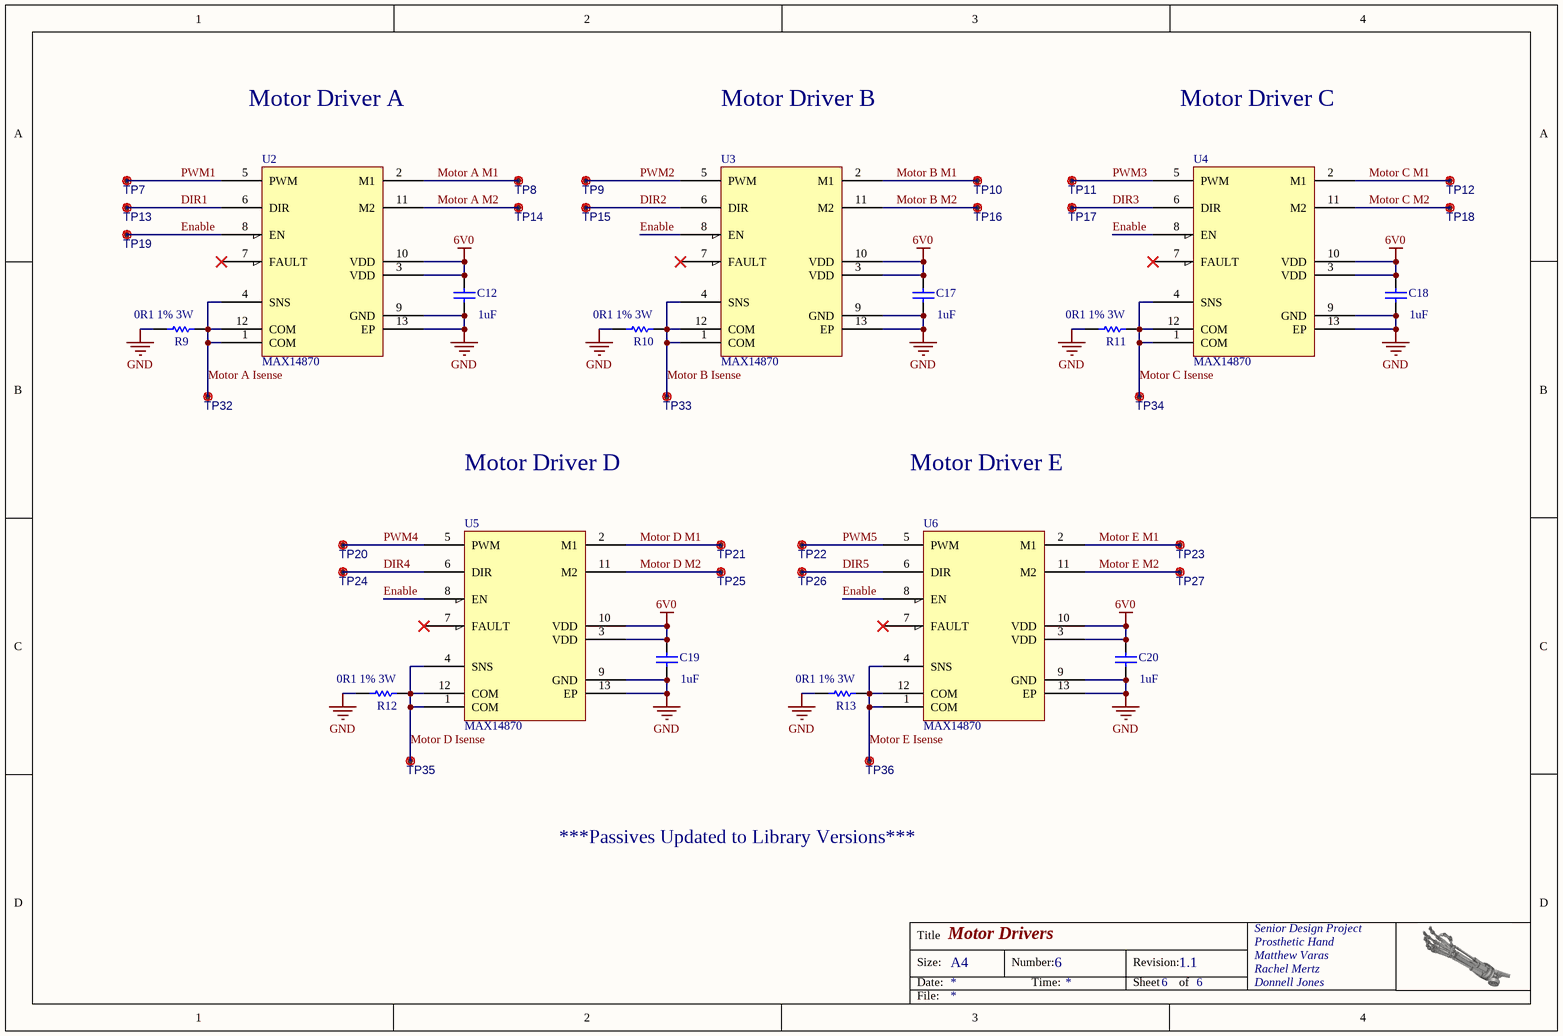
[diagram p5: Motor_Drivers.SchDoc]

### Parts
C12  value 1uF  [0402 Cap]  (hidden comment: Cap)
C17  value 1uF  [0402 Cap]  (hidden comment: Cap)
C18  value 1uF  [0402 Cap]  (hidden comment: Cap)
C19  value 1uF  [0402 Cap]  (hidden comment: Cap)
C20  value 1uF  [0402 Cap]  (hidden comment: Cap)
R9  0R1 1% 3W  [2512 Resistor]
R10  0R1 1% 3W  [2512 Resistor]
R11  0R1 1% 3W  [2512 Resistor]
R12  0R1 1% 3W  [2512 Resistor]
R13  0R1 1% 3W  [2512 Resistor]
TP7  Test Point  [Testpoint_70]  (value not drawn)
TP8  Test Point  [Testpoint_70]  (value not drawn)
TP9  Test Point  [Testpoint_70]  (value not drawn)
TP10  Test Point  [Testpoint_70]  (value not drawn)
TP11  Test Point  [Testpoint_70]  (value not drawn)
TP12  Test Point  [Testpoint_70]  (value not drawn)
TP13  Test Point  [Testpoint_70]  (value not drawn)
TP14  Test Point  [Testpoint_70]  (value not drawn)
TP15  Test Point  [Testpoint_70]  (value not drawn)
TP16  Test Point  [Testpoint_70]  (value not drawn)
TP17  Test Point  [Testpoint_70]  (value not drawn)
TP18  Test Point  [Testpoint_70]  (value not drawn)
TP19  Test Point  [Testpoint_70]  (value not drawn)
TP20  Test Point  [Testpoint_70]  (value not drawn)
TP21  Test Point  [Testpoint_70]  (value not drawn)
TP22  Test Point  [Testpoint_70]  (value not drawn)
TP23  Test Point  [Testpoint_70]  (value not drawn)
TP24  Test Point  [Testpoint_70]  (value not drawn)
TP25  Test Point  [Testpoint_70]  (value not drawn)
TP26  Test Point  [Testpoint_70]  (value not drawn)
TP27  Test Point  [Testpoint_70]  (value not drawn)
TP32  Test Point  [Testpoint_70]  (value not drawn)
TP33  Test Point  [Testpoint_70]  (value not drawn)
TP34  Test Point  [Testpoint_70]  (value not drawn)
TP35  Test Point  [Testpoint_70]  (value not drawn)
TP36  Test Point  [Testpoint_70]  (value not drawn)
U2  MAX14870  [12L TDFN 3x3]
U3  MAX14870  [12L TDFN 3x3]
U4  MAX14870  [12L TDFN 3x3]
U5  MAX14870  [12L TDFN 3x3]
U6  MAX14870  [12L TDFN 3x3]

### Nets
6V0: C12.2 C17.2 C18.2 C19.2 C20.2 U2.3(VDD) U2.10(VDD) U3.3(VDD) U3.10(VDD) U4.3(VDD) U4.10(VDD) U5.3(VDD) U5.10(VDD) U6.3(VDD) U6.10(VDD)
GND: C12.1 C17.1 C18.1 C19.1 C20.1 R9.1 R10.1 R11.1 R12.1 R13.1 U2.9(GND) U2.13(EP) U3.9(GND) U3.13(EP) U4.9(GND) U4.13(EP) U5.9(GND) U5.13(EP) U6.9(GND) U6.13(EP)
DIR1: TP13.1(M80) U2.6(DIR)
DIR2: TP15.1(M80) U3.6(DIR)
DIR3: TP17.1(M80) U4.6(DIR)
DIR4: TP24.1(M80) U5.6(DIR)
DIR5: TP26.1(M80) U6.6(DIR)
Enable: TP19.1(M80) U2.8(EN) U3.8(EN) U4.8(EN) U5.8(EN) U6.8(EN)
Motor A Isense: R9.2 TP32.1(M80) U2.1(COM) U2.4(SNS) U2.12(COM)
Motor A M1: TP8.1(M80) U2.2(M1)
Motor A M2: TP14.1(M80) U2.11(M2)
Motor B Isense: R10.2 TP33.1(M80) U3.1(COM) U3.4(SNS) U3.12(COM)
Motor B M1: TP10.1(M80) U3.2(M1)
Motor B M2: TP16.1(M80) U3.11(M2)
Motor C Isense: R11.2 TP34.1(M80) U4.1(COM) U4.4(SNS) U4.12(COM)
Motor C M1: TP12.1(M80) U4.2(M1)
Motor C M2: TP18.1(M80) U4.11(M2)
Motor D Isense: R12.2 TP35.1(M80) U5.1(COM) U5.4(SNS) U5.12(COM)
Motor D M1: TP21.1(M80) U5.2(M1)
Motor D M2: TP25.1(M80) U5.11(M2)
Motor E Isense: R13.2 TP36.1(M80) U6.1(COM) U6.4(SNS) U6.12(COM)
Motor E M1: TP23.1(M80) U6.2(M1)
Motor E M2: TP27.1(M80) U6.11(M2)
PWM1: TP7.1(M80) U2.5(PWM)
PWM2: TP9.1(M80) U3.5(PWM)
PWM3: TP11.1(M80) U4.5(PWM)
PWM4: TP20.1(M80) U5.5(PWM)
PWM5: TP22.1(M80) U6.5(PWM)

Not connected (* = marked no-connect by the designer): U2 7(FAULT)*; U3 7(FAULT)*; U4 7(FAULT)*; U5 7(FAULT)*; U6 7(FAULT)*

### Notes on the sheet
- Motor Driver A
- Motor Driver B
- Motor Driver C
- Motor Driver D
- Motor Driver E
- ***Passives Updated to Library Versions***
- Title
- Size:
- Date:
- A4
- Number:
- Time:
- Revision:
- Sheet
- of
- File:

### Library data of the parts
C12 C17-C20 = Cap 0402: 1µF ±10% 16V X5R Ceramic Capacitor 0402; DIGI_PN01: 490-12255-1-ND; MFG_PN01: GRT155R61C105KE01D; MFG_NAME01: Murata; Footprint: 0402
R9-R13 = Resistor 2512: RES SMD 0.1 OHM 1% 3W 2512; DIGI_PN01: CRA2512-FZ-R100ELFCT-ND; MFG_PN01: CRA2512-FZ-R100ELF; MFG_NAME01: Bourns Inc.; Value: 0R1; Footprint: 2512
TP7-TP27 TP32-TP36 = Test Point: Test Pad; MFG_PN01: DNP; MFG_NAME01: DNP; DNP: DNP
U2-U6 = MAX14870: IC MOTOR DVR DC FULL BR 12TDFN; MFG_NAME01: Maxim Integrated; MFG_PN01: MAX14870ETC+T; DIGI_PN01: MAX14870ETC+CT-ND; Case-EIA: 12-WFDFN

## Nets that join several sheets
3V3: Connectors (J5.1), Power_Supply (8 pins)
6V0: Connectors (SW3.1), Power_Supply (J6.2 J?#3.2 TP30.1), Motor_Drivers (15 pins)
12V0: Connectors (SW2.1), Battery Manager (D?#1.2)
GND: Connectors (10 pins), MCU (33 pins), Battery Manager (17 pins), Power_Supply (19 pins), Motor_Drivers (20 pins)
VBAT: Connectors (SW1.1 TP4.1), Battery Manager (5 pins)
VDD: MCU (21 pins), Power_Supply (J12.2)
VSYS: Connectors (SW2.3), Battery Manager (5 pins), Power_Supply (10 pins)
DIR1: Connectors (J5.11), Motor_Drivers (TP13.1 U2.6)
DIR2: Connectors (J5.15), Motor_Drivers (TP15.1 U3.6)
DIR3: Connectors (J5.19), Motor_Drivers (TP17.1 U4.6)
DIR4: Connectors (J5.23), Motor_Drivers (TP24.1 U5.6)
DIR5: Connectors (J5.27), Motor_Drivers (TP26.1 U6.6)
Enable: Connectors (J5.9), Motor_Drivers (6 pins)
Motor A Isense: Connectors (J5.3), Motor_Drivers (5 pins)
Motor A M1: Connectors (J7.6), Motor_Drivers (TP8.1 U2.2)
Motor A M2: Connectors (J7.5), Motor_Drivers (TP14.1 U2.11)
Motor B Isense: Connectors (J5.4), Motor_Drivers (5 pins)
Motor B M1: Connectors (J8.6), Motor_Drivers (TP10.1 U3.2)
Motor B M2: Connectors (J8.5), Motor_Drivers (TP16.1 U3.11)
Motor C Isense: Connectors (J5.5), Motor_Drivers (5 pins)
Motor C M1: Connectors (J9.6), Motor_Drivers (TP12.1 U4.2)
Motor C M2: Connectors (J9.5), Motor_Drivers (TP18.1 U4.11)
Motor D Isense: Connectors (J5.6), Motor_Drivers (5 pins)
Motor D M1: Connectors (J10.6), Motor_Drivers (TP21.1 U5.2)
Motor D M2: Connectors (J10.5), Motor_Drivers (TP25.1 U5.11)
Motor E Isense: Connectors (J5.7), Motor_Drivers (5 pins)
Motor E M1: Connectors (J11.6), Motor_Drivers (TP23.1 U6.2)
Motor E M2: Connectors (J11.5), Motor_Drivers (TP27.1 U6.11)
PWM1: Connectors (J5.10), Motor_Drivers (TP7.1 U2.5)
PWM2: Connectors (J5.14), Motor_Drivers (TP9.1 U3.5)
PWM3: Connectors (J5.18), Motor_Drivers (TP11.1 U4.5)
PWM4: Connectors (J5.22), Motor_Drivers (TP20.1 U5.5)
PWM5: Connectors (J5.26), Motor_Drivers (TP22.1 U6.5)

## Assembly variants
Only Fitted Components: not fitted C1 U4